# EAGLE design Schaltplan (EAGLE 9.5.1)
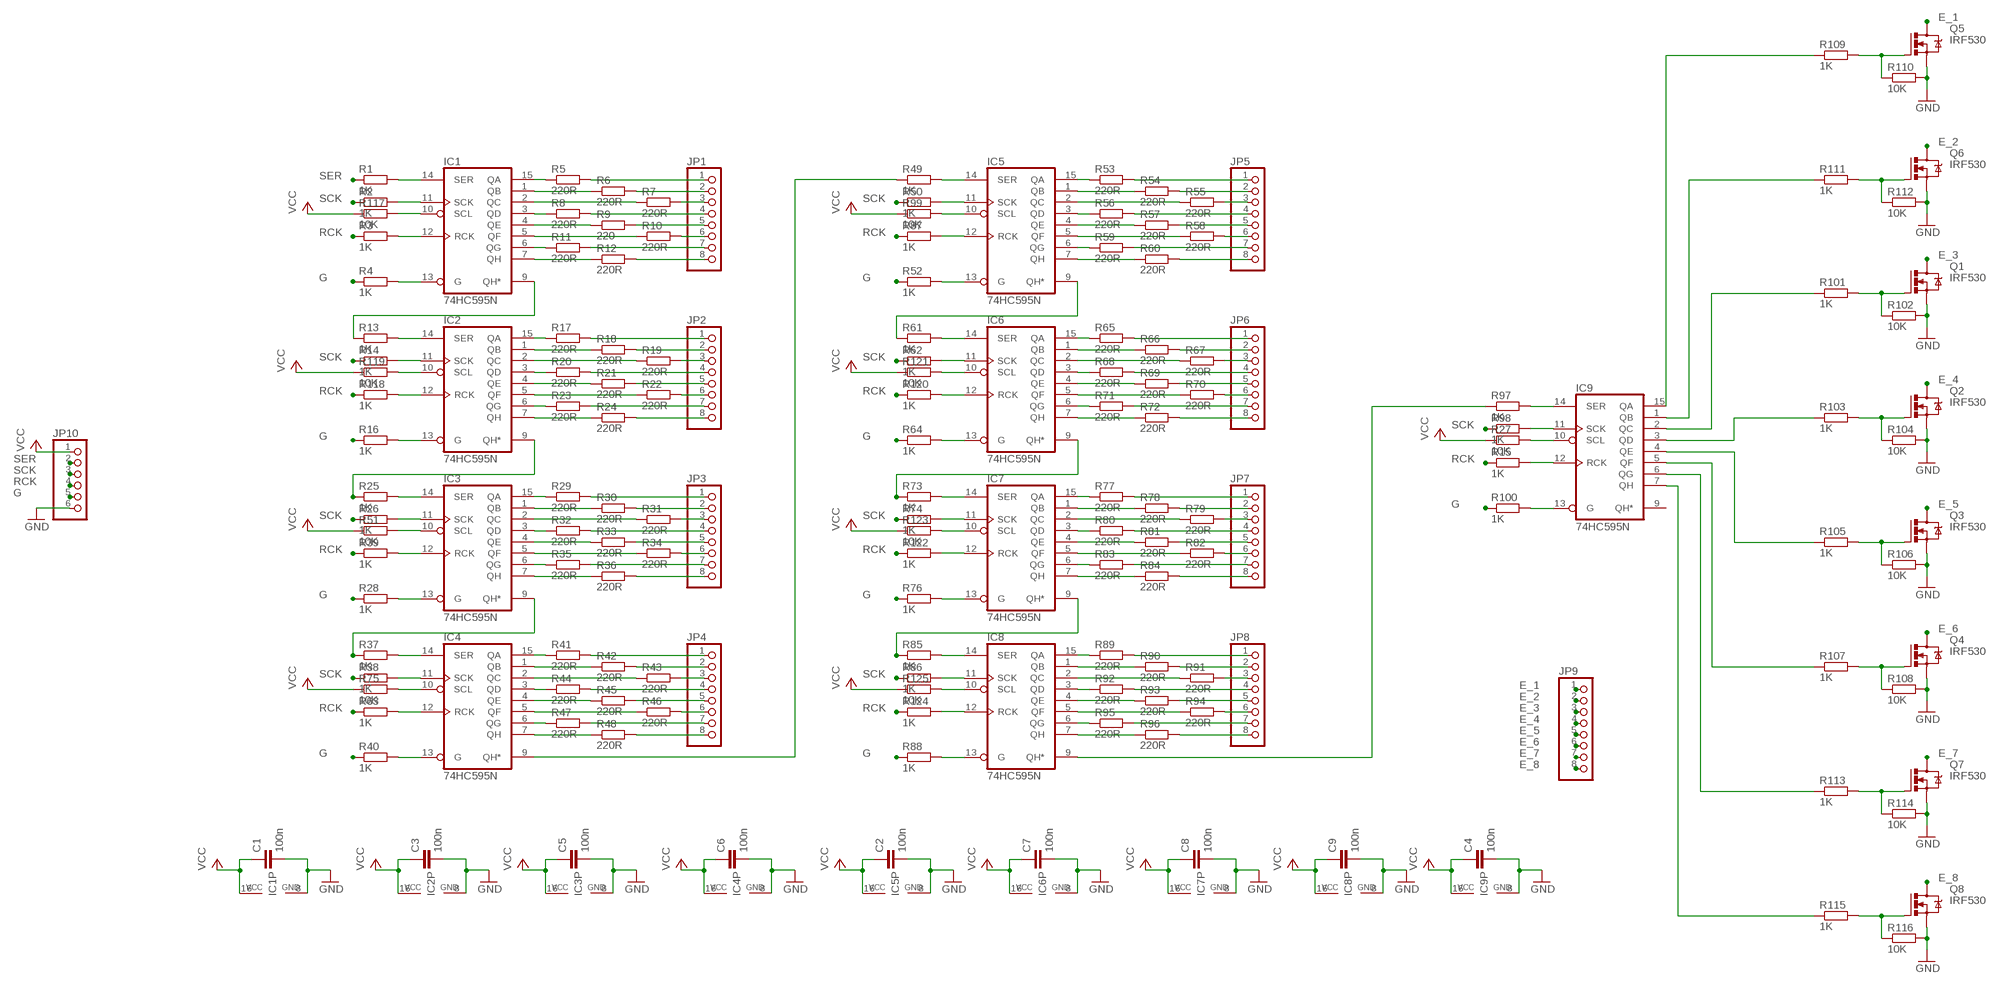
[diagram p0: schematic, sheet 1]

## Parts
C1  100n  C5/3  [C5B3]
C2  100n  C5/3  [C5B3]
C3  100n  C5/3  [C5B3]
C4  100n  C5/3  [C5B3]
C5  100n  C5/3  [C5B3]
C6  100n  C5/3  [C5B3]
C7  100n  C5/3  [C5B3]
C8  100n  C5/3  [C5B3]
C9  100n  C5/3  [C5B3]
IC1  74HC595N  [DIL16]
IC2  74HC595N  [DIL16]
IC3  74HC595N  [DIL16]
IC4  74HC595N  [DIL16]
IC5  74HC595N  [DIL16]
IC6  74HC595N  [DIL16]
IC7  74HC595N  [DIL16]
IC8  74HC595N  [DIL16]
IC9  74HC595N  [DIL16]
JP1  PINHD-1X8  [1X08]
JP2  PINHD-1X8  [1X08]
JP3  PINHD-1X8  [1X08]
JP4  PINHD-1X8  [1X08]
JP5  PINHD-1X8  [1X08]
JP6  PINHD-1X8  [1X08]
JP7  PINHD-1X8  [1X08]
JP8  PINHD-1X8  [1X08]
JP9  PINHD-1X8  [1X08]
JP10  PINHD-1X6  [1X06]
Q1  IRF530  [TO220BV]
Q2  IRF530  [TO220BV]
Q3  IRF530  [TO220BV]
Q4  IRF530  [TO220BV]
Q5  IRF530  [TO220BV]
Q6  IRF530  [TO220BV]
Q7  IRF530  [TO220BV]
Q8  IRF530  [TO220BV]
R1  1K  R-EU_0207/10  [0207/10]
R2  1K  R-EU_0207/10  [0207/10]
R3  1K  R-EU_0207/10  [0207/10]
R4  1K  R-EU_0207/10  [0207/10]
R5  220R  R-EU_0207/10  [0207/10]
R6  220R  R-EU_0207/10  [0207/10]
R7  220R  R-EU_0207/10  [0207/10]
R8  220R  R-EU_0207/10  [0207/10]
R9  220  R-EU_0207/10  [0207/10]
R10  220R  R-EU_0207/10  [0207/10]
R11  220R  R-EU_0207/10  [0207/10]
R12  220R  R-EU_0207/10  [0207/10]
R13  1K  R-EU_0207/10  [0207/10]
R14  1K  R-EU_0207/10  [0207/10]
R15  1K  R-EU_0207/10  [0207/10]
R16  1K  R-EU_0207/10  [0207/10]
R17  220R  R-EU_0207/10  [0207/10]
R18  220R  R-EU_0207/10  [0207/10]
R19  220R  R-EU_0207/10  [0207/10]
R20  220R  R-EU_0207/10  [0207/10]
R21  220R  R-EU_0207/10  [0207/10]
R22  220R  R-EU_0207/10  [0207/10]
R23  220R  R-EU_0207/10  [0207/10]
R24  220R  R-EU_0207/10  [0207/10]
R25  1K  R-EU_0207/10  [0207/10]
R26  1K  R-EU_0207/10  [0207/10]
R27  10K  R-EU_0207/10  [0207/10]
R28  1K  R-EU_0207/10  [0207/10]
R29  220R  R-EU_0207/10  [0207/10]
R30  220R  R-EU_0207/10  [0207/10]
R31  220R  R-EU_0207/10  [0207/10]
R32  220R  R-EU_0207/10  [0207/10]
R33  220R  R-EU_0207/10  [0207/10]
R34  220R  R-EU_0207/10  [0207/10]
R35  220R  R-EU_0207/10  [0207/10]
R36  220R  R-EU_0207/10  [0207/10]
R37  1K  R-EU_0207/10  [0207/10]
R38  1K  R-EU_0207/10  [0207/10]
R39  1K  R-EU_0207/10  [0207/10]
R40  1K  R-EU_0207/10  [0207/10]
R41  220R  R-EU_0207/10  [0207/10]
R42  220R  R-EU_0207/10  [0207/10]
R43  220R  R-EU_0207/10  [0207/10]
R44  220R  R-EU_0207/10  [0207/10]
R45  220R  R-EU_0207/10  [0207/10]
R46  220R  R-EU_0207/10  [0207/10]
R47  220R  R-EU_0207/10  [0207/10]
R48  220R  R-EU_0207/10  [0207/10]
R49  1K  R-EU_0207/10  [0207/10]
R50  1K  R-EU_0207/10  [0207/10]
R51  10K  R-EU_0207/10  [0207/10]
R52  1K  R-EU_0207/10  [0207/10]
R53  220R  R-EU_0207/10  [0207/10]
R54  220R  R-EU_0207/10  [0207/10]
R55  220R  R-EU_0207/10  [0207/10]
R56  220R  R-EU_0207/10  [0207/10]
R57  220R  R-EU_0207/10  [0207/10]
R58  220R  R-EU_0207/10  [0207/10]
R59  220R  R-EU_0207/10  [0207/10]
R60  220R  R-EU_0207/10  [0207/10]
R61  1K  R-EU_0207/10  [0207/10]
R62  1K  R-EU_0207/10  [0207/10]
R63  1K  R-EU_0207/10  [0207/10]
R64  1K  R-EU_0207/10  [0207/10]
R65  220R  R-EU_0207/10  [0207/10]
R66  220R  R-EU_0207/10  [0207/10]
R67  220R  R-EU_0207/10  [0207/10]
R68  220R  R-EU_0207/10  [0207/10]
R69  220R  R-EU_0207/10  [0207/10]
R70  220R  R-EU_0207/10  [0207/10]
R71  220R  R-EU_0207/10  [0207/10]
R72  220R  R-EU_0207/10  [0207/10]
R73  1K  R-EU_0207/10  [0207/10]
R74  1K  R-EU_0207/10  [0207/10]
R75  10K  R-EU_0207/10  [0207/10]
R76  1K  R-EU_0207/10  [0207/10]
R77  220R  R-EU_0207/10  [0207/10]
R78  220R  R-EU_0207/10  [0207/10]
R79  220R  R-EU_0207/10  [0207/10]
R80  220R  R-EU_0207/10  [0207/10]
R81  220R  R-EU_0207/10  [0207/10]
R82  220R  R-EU_0207/10  [0207/10]
R83  220R  R-EU_0207/10  [0207/10]
R84  220R  R-EU_0207/10  [0207/10]
R85  1K  R-EU_0207/10  [0207/10]
R86  1K  R-EU_0207/10  [0207/10]
R87  1K  R-EU_0207/10  [0207/10]
R88  1K  R-EU_0207/10  [0207/10]
R89  220R  R-EU_0207/10  [0207/10]
R90  220R  R-EU_0207/10  [0207/10]
R91  220R  R-EU_0207/10  [0207/10]
R92  220R  R-EU_0207/10  [0207/10]
R93  220R  R-EU_0207/10  [0207/10]
R94  220R  R-EU_0207/10  [0207/10]
R95  220R  R-EU_0207/10  [0207/10]
R96  220R  R-EU_0207/10  [0207/10]
R97  1K  R-EU_0207/10  [0207/10]
R98  1K  R-EU_0207/10  [0207/10]
R99  10K  R-EU_0207/10  [0207/10]
R100  1K  R-EU_0207/10  [0207/10]
R101  1K  R-EU_0207/10  [0207/10]
R102  10K  R-EU_0207/10  [0207/10]
R103  1K  R-EU_0207/10  [0207/10]
R104  10K  R-EU_0207/10  [0207/10]
R105  1K  R-EU_0207/10  [0207/10]
R106  10K  R-EU_0207/10  [0207/10]
R107  1K  R-EU_0207/10  [0207/10]
R108  10K  R-EU_0207/10  [0207/10]
R109  1K  R-EU_0207/10  [0207/10]
R110  10K  R-EU_0207/10  [0207/10]
R111  1K  R-EU_0207/10  [0207/10]
R112  10K  R-EU_0207/10  [0207/10]
R113  1K  R-EU_0207/10  [0207/10]
R114  10K  R-EU_0207/10  [0207/10]
R115  1K  R-EU_0207/10  [0207/10]
R116  10K  R-EU_0207/10  [0207/10]
R117  10K  R-EU_0207/10  [0207/10]
R118  1K  R-EU_0207/10  [0207/10]
R119  10K  R-EU_0207/10  [0207/10]
R120  1K  R-EU_0207/10  [0207/10]
R121  10K  R-EU_0207/10  [0207/10]
R122  1K  R-EU_0207/10  [0207/10]
R123  10K  R-EU_0207/10  [0207/10]
R124  1K  R-EU_0207/10  [0207/10]
R125  10K  R-EU_0207/10  [0207/10]

## Nets
E_1: JP9.1 Q5.D
E_2: JP9.2 Q6.D
E_3: JP9.3 Q1.D
E_4: JP9.4 Q2.D
E_5: JP9.5 Q3.D
E_6: JP9.6 Q4.D
E_7: JP9.7 Q7.D
E_8: JP9.8 Q8.D
G: JP10.5 R4.1 R16.1 R28.1 R40.1 R52.1 R64.1 R76.1 R88.1 R100.1
GND: C1.2 C2.2 C3.2 C4.2 C5.2 C6.2 C7.2 C8.2 C9.2 IC1.8(GND) IC2.8(GND) IC3.8(GND) IC4.8(GND) IC5.8(GND) IC6.8(GND) IC7.8(GND) IC8.8(GND) IC9.8(GND) JP10.6 Q1.S Q2.S Q3.S Q4.S Q5.S Q6.S Q7.S Q8.S R102.2 R104.2 R106.2 R108.2 R110.2 R112.2 R114.2 R116.2
N$1: IC1.14(SER) R1.2
N$2: IC1.11(SCK) R2.2
N$3: IC1.12(RCK) R3.2
N$4: IC1.13(G) R4.2
N$5: JP1.1 R5.2
N$6: IC1.15(QA) R5.1
N$7: IC1.1(QB) R6.1
N$8: JP1.2 R6.2
N$9: JP1.3 R7.2
N$10: IC1.2(QC) R7.1
N$11: IC1.3(QD) R8.1
N$12: JP1.4 R8.2
N$13: JP1.5 R9.2
N$14: IC1.4(QE) R9.1
N$15: IC1.5(QF) R10.1
N$16: JP1.6 R10.2
N$17: JP1.7 R11.2
N$18: IC1.6(QG) R11.1
N$19: IC1.7(QH) R12.1
N$20: JP1.8 R12.2
N$21: IC2.14(SER) R13.2
N$22: IC2.11(SCK) R14.2
N$23: IC2.10(SCL) R119.2
N$24: IC2.13(G) R16.2
N$25: JP2.1 R17.2
N$26: IC2.15(QA) R17.1
N$27: IC2.1(QB) R18.1
N$28: JP2.2 R18.2
N$29: JP2.3 R19.2
N$30: IC2.2(QC) R19.1
N$31: IC2.3(QD) R20.1
N$32: JP2.4 R20.2
N$33: JP2.5 R21.2
N$34: IC2.4(QE) R21.1
N$35: IC2.5(QF) R22.1
N$36: JP2.6 R22.2
N$37: JP2.7 R23.2
N$38: IC2.6(QG) R23.1
N$39: IC2.7(QH) R24.1
N$40: JP2.8 R24.2
N$41: IC3.14(SER) R25.2
N$42: IC3.11(SCK) R26.2
N$43: IC3.12(RCK) R39.2
N$44: IC3.13(G) R28.2
N$45: JP3.1 R29.2
N$46: IC3.15(QA) R29.1
N$47: IC3.1(QB) R30.1
N$48: JP3.2 R30.2
N$49: JP3.3 R31.2
N$50: IC3.2(QC) R31.1
N$51: IC3.3(QD) R32.1
N$52: JP3.4 R32.2
N$53: JP3.5 R33.2
N$54: IC3.4(QE) R33.1
N$55: IC3.5(QF) R34.1
N$56: JP3.6 R34.2
N$57: JP3.7 R35.2
N$58: IC3.6(QG) R35.1
N$59: IC3.7(QH) R36.1
N$60: JP3.8 R36.2
N$61: IC4.14(SER) R37.2
N$62: IC4.11(SCK) R38.2
N$63: IC3.10(SCL) R51.2
N$64: IC4.13(G) R40.2
N$65: JP4.1 R41.2
N$66: IC4.15(QA) R41.1
N$67: IC4.1(QB) R42.1
N$68: JP4.2 R42.2
N$69: JP4.3 R43.2
N$70: IC4.2(QC) R43.1
N$71: IC4.3(QD) R44.1
N$72: JP4.4 R44.2
N$73: JP4.5 R45.2
N$74: IC4.4(QE) R45.1
N$75: IC4.5(QF) R46.1
N$76: JP4.6 R46.2
N$77: JP4.7 R47.2
N$78: IC4.6(QG) R47.1
N$79: IC4.7(QH) R48.1
N$80: JP4.8 R48.2
N$81: IC5.14(SER) R49.2
N$82: IC5.11(SCK) R50.2
N$83: IC4.10(SCL) R75.2
N$84: IC5.13(G) R52.2
N$85: JP5.1 R53.2
N$86: IC5.15(QA) R53.1
N$87: IC5.1(QB) R54.1
N$88: JP5.2 R54.2
N$89: JP5.3 R55.2
N$90: IC5.2(QC) R55.1
N$91: IC5.3(QD) R56.1
N$92: JP5.4 R56.2
N$93: JP5.5 R57.2
N$94: IC5.4(QE) R57.1
N$95: IC5.5(QF) R58.1
N$96: JP5.6 R58.2
N$97: JP5.7 R59.2
N$98: IC5.6(QG) R59.1
N$99: IC5.7(QH) R60.1
N$100: JP5.8 R60.2
N$101: IC6.14(SER) R61.2
N$102: IC6.11(SCK) R62.2
N$103: IC4.12(RCK) R63.2
N$104: IC6.13(G) R64.2
N$105: JP6.1 R65.2
N$106: IC6.15(QA) R65.1
N$107: IC6.1(QB) R66.1
N$108: JP6.2 R66.2
N$109: JP6.3 R67.2
N$110: IC6.2(QC) R67.1
N$111: IC6.3(QD) R68.1
N$112: JP6.4 R68.2
N$113: JP6.5 R69.2
N$114: IC6.4(QE) R69.1
N$115: IC6.5(QF) R70.1
N$116: JP6.6 R70.2
N$117: JP6.7 R71.2
N$118: IC6.6(QG) R71.1
N$119: IC6.7(QH) R72.1
N$120: JP6.8 R72.2
N$121: IC7.14(SER) R73.2
N$122: IC7.11(SCK) R74.2
N$123: IC6.10(SCL) R121.2
N$124: IC7.13(G) R76.2
N$125: JP7.1 R77.2
N$126: IC7.15(QA) R77.1
N$127: IC7.1(QB) R78.1
N$128: JP7.2 R78.2
N$129: JP7.3 R79.2
N$130: IC7.2(QC) R79.1
N$131: IC7.3(QD) R80.1
N$132: JP7.4 R80.2
N$133: JP7.5 R81.2
N$134: IC7.4(QE) R81.1
N$135: IC7.5(QF) R82.1
N$136: JP7.6 R82.2
N$137: JP7.7 R83.2
N$138: IC7.6(QG) R83.1
N$139: IC7.7(QH) R84.1
N$140: JP7.8 R84.2
N$141: IC8.14(SER) R85.2
N$142: IC8.11(SCK) R86.2
N$143: IC6.12(RCK) R120.2
N$144: IC8.13(G) R88.2
N$145: JP8.1 R89.2
N$146: IC8.15(QA) R89.1
N$147: IC8.1(QB) R90.1
N$148: JP8.2 R90.2
N$149: JP8.3 R91.2
N$150: IC8.2(QC) R91.1
N$151: IC8.3(QD) R92.1
N$152: JP8.4 R92.2
N$153: JP8.5 R93.2
N$154: IC8.4(QE) R93.1
N$155: IC8.5(QF) R94.1
N$156: JP8.6 R94.2
N$157: JP8.7 R95.2
N$158: IC8.6(QG) R95.1
N$159: IC8.7(QH) R96.1
N$160: JP8.8 R96.2
N$161: IC9.14(SER) R97.2
N$162: IC9.11(SCK) R98.2
N$163: IC7.10(SCL) R123.2
N$164: IC9.13(G) R100.2
N$165: Q1.G R101.2 R102.1
N$166: Q2.G R103.2 R104.1
N$167: Q3.G R105.2 R106.1
N$168: Q4.G R107.2 R108.1
N$169: Q5.G R109.2 R110.1
N$170: Q6.G R111.2 R112.1
N$171: Q7.G R113.2 R114.1
N$172: Q8.G R115.2 R116.1
N$173: IC9.15(QA) R109.1
N$174: IC9.1(QB) R111.1
N$175: IC9.2(QC) R101.1
N$176: IC9.3(QD) R103.1
N$177: IC9.4(QE) R105.1
N$178: IC9.5(QF) R107.1
N$179: IC9.6(QG) R113.1
N$180: IC9.7(QH) R115.1
N$181: IC8.9(QH*) R97.1
N$182: IC1.9(QH*) R13.1
N$183: IC4.9(QH*) R49.1
N$184: IC5.9(QH*) R61.1
N$185: IC1.10(SCL) R117.2
N$186: IC2.12(RCK) R118.2
N$187: IC7.12(RCK) R122.2
N$188: IC8.10(SCL) R125.2
N$189: IC8.12(RCK) R124.2
N$190: IC5.10(SCL) R99.2
N$191: IC5.12(RCK) R87.2
N$192: IC9.10(SCL) R27.2
N$193: IC9.12(RCK) R15.2
RCK: JP10.4 R3.1 R15.1 R39.1 R63.1 R87.1 R118.1 R120.1 R122.1 R124.1
SCK: JP10.3 R2.1 R14.1 R26.1 R38.1 R50.1 R62.1 R74.1 R86.1 R98.1
SER: JP10.2 R1.1
SER1: IC2.9(QH*) R25.1
SER2: IC3.9(QH*) R37.1
SER3: IC6.9(QH*) R73.1
SER4: IC7.9(QH*) R85.1
VCC: C1.1 C2.1 C3.1 C4.1 C5.1 C6.1 C7.1 C8.1 C9.1 IC1.16(VCC) IC2.16(VCC) IC3.16(VCC) IC4.16(VCC) IC5.16(VCC) IC6.16(VCC) IC7.16(VCC) IC8.16(VCC) IC9.16(VCC) JP10.1 R27.1 R51.1 R75.1 R99.1 R117.1 R119.1 R121.1 R123.1 R125.1
Unconnected: IC9.9(QH*)

## Library data of the parts
C1-C9 = capacitor-wima:C: CAPACITOR naming: grid - package width
IC1-IC9 = 74xx-eu:74*595: 8-bit SHIFT REGISTER, output latch
JP1-JP9 = pinhead:PINHD-1X8: PIN HEADER
JP10 = pinhead:PINHD-1X6: PIN HEADER
Q1-Q8 = transistor-power:IRF530: HEXFET Power MOSFET
R1-R125 = resistor:R-EU_: RESISTOR, European symbol

## Board
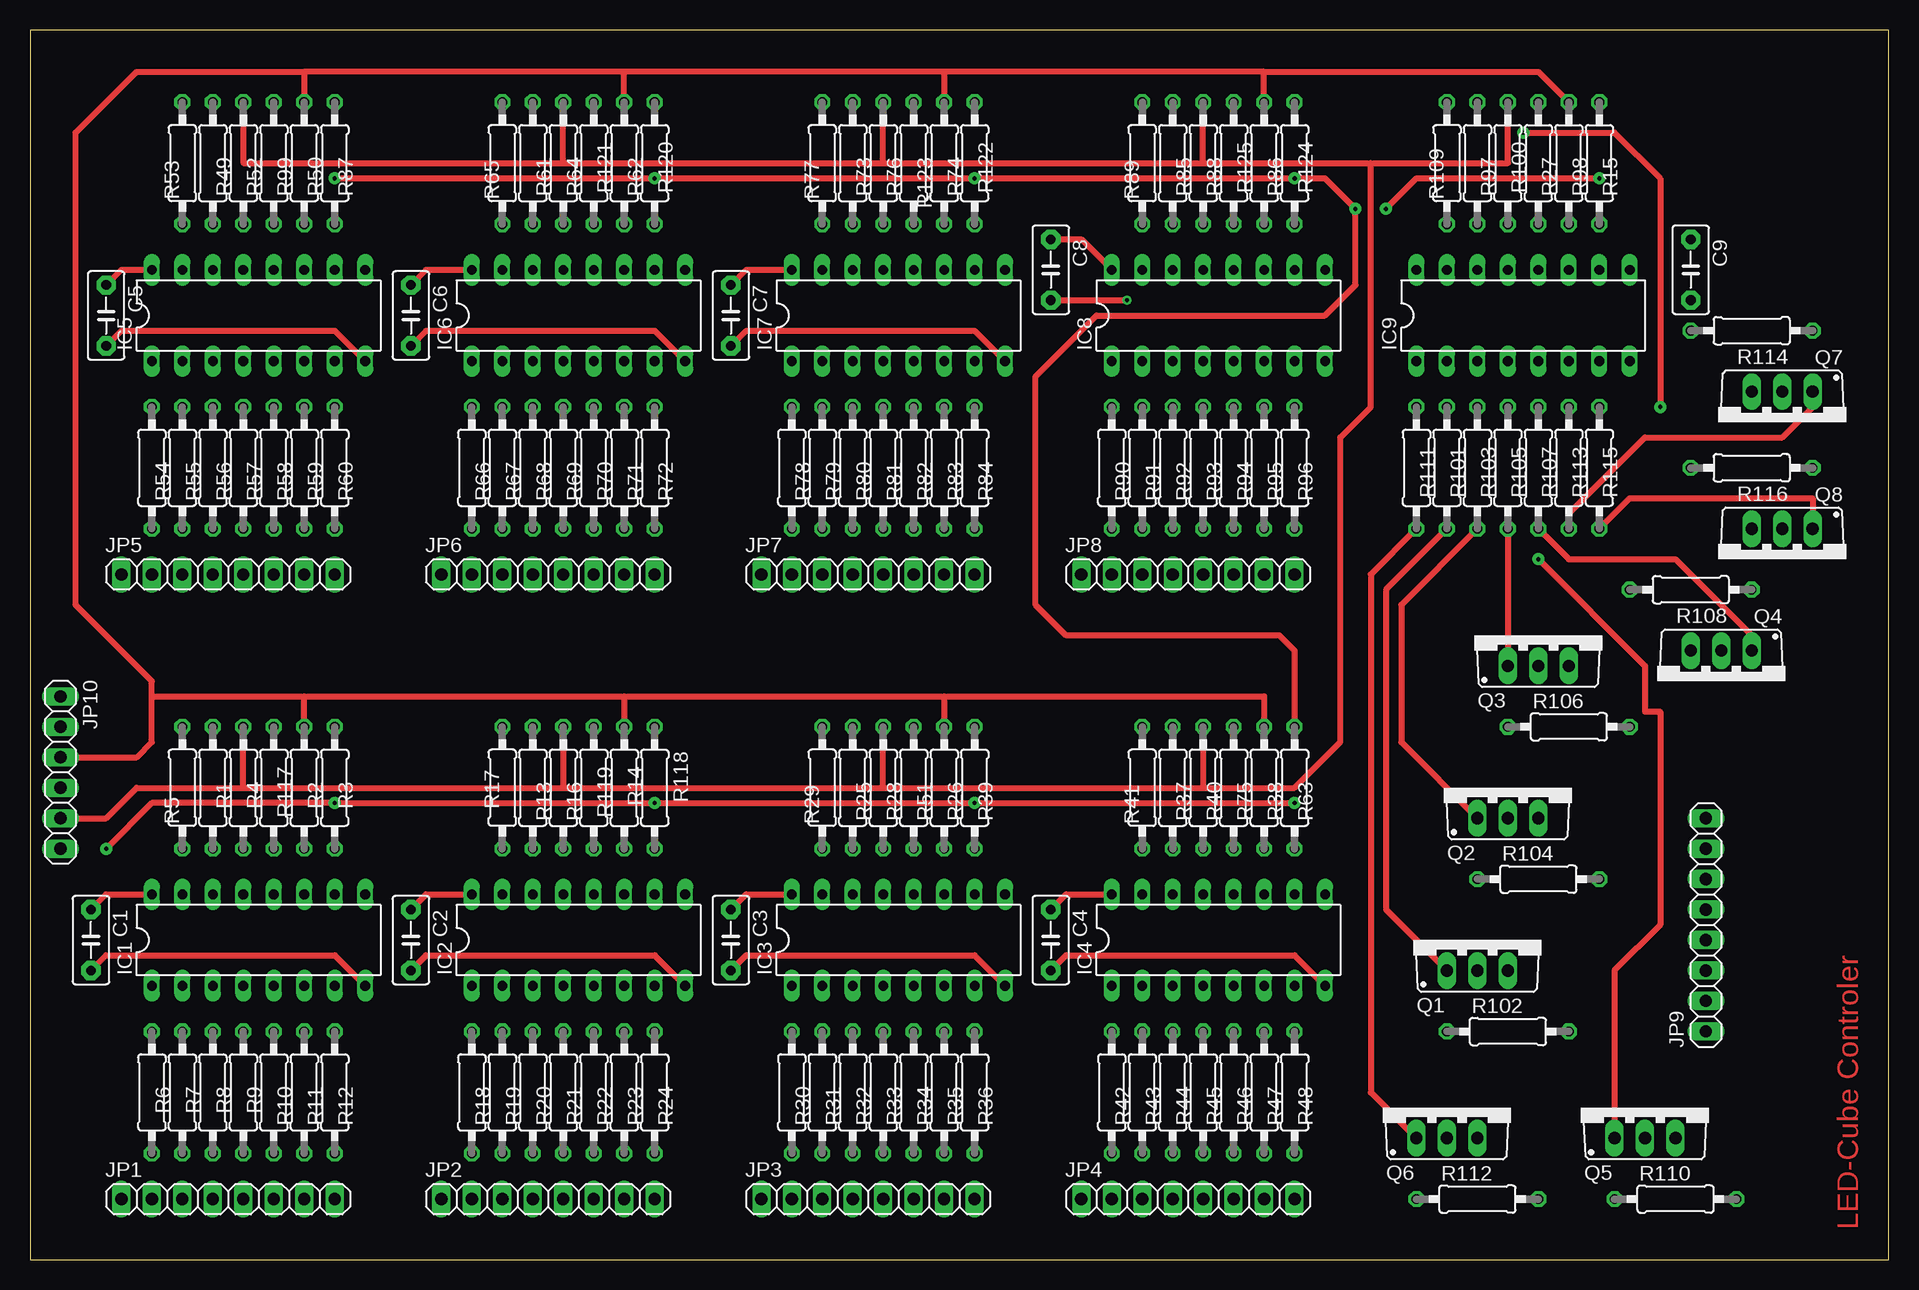
[diagram p1: board, top side]
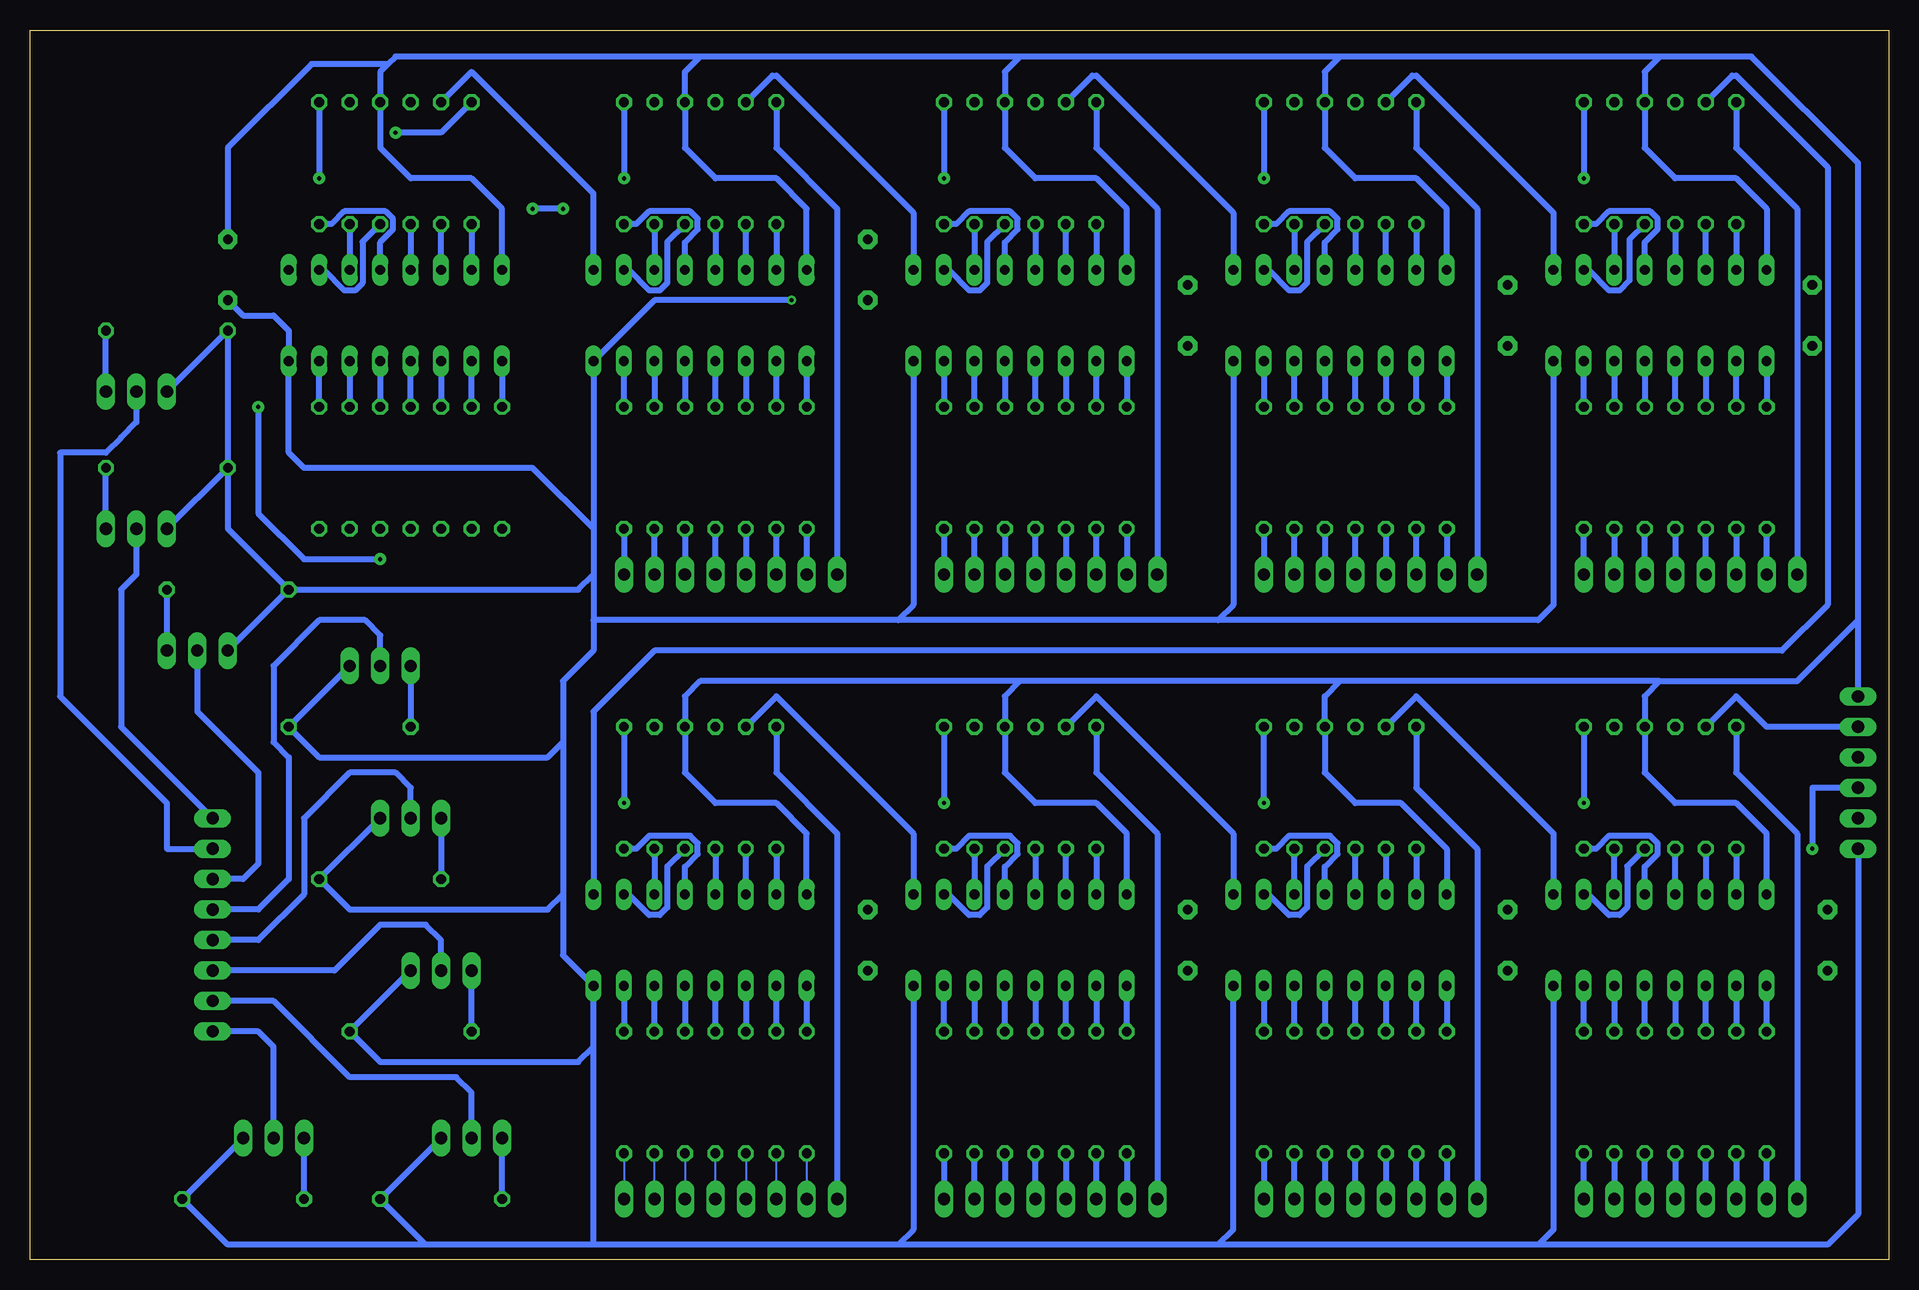
[diagram p2: board, bottom side, seen from below]

Size 154.92 x 102.54 mm. Coordinates in mm from the lower left corner, seen from the top.
Outline: 0,0 154.92,0 154.92,102.54 0,102.54 0,0
Copper layers (1*16): Top 0.035mm / dielectric 1.5mm / Bottom 0.035mm
Design rules "default": minimum track width 6mil, minimum drill 0.35mm, track to track 6mil, track to pad 6mil, pad to pad 6mil, via to via 6mil, smd to smd 6mil, copper to edge 40mil, drill to drill 6mil, minimum pad ring 10mil, minimum via ring 8mil, stop-mask expansion 4mil, vias tented up to drill 0mil, thermal gap 10mil

### Footprints (pad centres in the part's own frame; a part is rotated, then mirrored left to right if it is on the bottom)
C5B3 = drill 0.813 pad 1.6 octagon: 1 -2.54,0; 2 2.54,0
DIL16 = drill 0.813 long: 1 -8.89,-3.81; 2 -6.35,-3.81; 3 -3.81,-3.81; 4 -1.27,-3.81; 5 1.27,-3.81; 6 3.81,-3.81; 7 6.35,-3.81; 8 8.89,-3.81; 9 8.89,3.81; 10 6.35,3.81; 11 3.81,3.81; 12 1.27,3.81; 13 -1.27,3.81; 14 -3.81,3.81; 15 -6.35,3.81; 16 -8.89,3.81
1X08 = drill 1.016 long: 1 -8.89,0; 2 -6.35,0; 3 -3.81,0; 4 -1.27,0; 5 1.27,0; 6 3.81,0; 7 6.35,0; 8 8.89,0
1X06 = drill 1.016 long: 1 -6.35,0; 2 -3.81,0; 3 -1.27,0; 4 1.27,0; 5 3.81,0; 6 6.35,0
TO220BV = drill 1.016 long: D 0,-2.54; G -2.54,-2.54; S 2.54,-2.54
0207/10 = drill 0.813 octagon: 1 -5.08,0; 2 5.08,0

### Placement (x,y rotation side)
C1  5.08,26.67 270 top
C2  31.75,26.67 270 top
C3  58.42,26.67 270 top
C4  85.09,26.67 270 top
C5  6.35,78.74 270 top
C6  31.75,78.74 270 top
C7  58.42,78.74 270 top
C8  85.09,82.55 270 top
C9  138.43,82.55 270 top
IC1  19.05,26.67 0 top
IC2  45.72,26.67 0 top
IC3  72.39,26.67 0 top
IC4  99.06,26.67 0 top
IC5  19.05,78.74 0 top
IC6  45.72,78.74 0 top
IC7  72.39,78.74 0 top
IC8  99.06,78.74 0 top
IC9  124.46,78.74 0 top
JP1  16.51,5.08 0 top
JP2  43.18,5.08 0 top
JP3  69.85,5.08 0 top
JP4  96.52,5.08 0 top
JP5  16.51,57.15 0 top
JP6  43.18,57.15 0 top
JP7  69.85,57.15 0 top
JP8  96.52,57.15 0 top
JP9  139.7,27.94 90 top
JP10  2.54,40.64 270 top
Q1  120.65,26.67 0 top
Q2  123.19,39.37 0 top
Q3  125.73,52.07 0 top
Q4  140.97,48.26 180 top
Q5  134.62,12.7 0 top
Q6  118.11,12.7 0 top
Q7  146.05,69.85 180 top
Q8  146.05,58.42 180 top
R1  15.24,39.37 270 top
R2  22.86,39.37 270 top
R3  25.4,39.37 270 top
R4  17.78,39.37 270 top
R5  12.7,39.37 90 top
R6  10.16,13.97 270 top
R7  12.7,13.97 270 top
R8  15.24,13.97 270 top
R9  17.78,13.97 270 top
R10  20.32,13.97 270 top
R11  22.86,13.97 270 top
R12  25.4,13.97 270 top
R13  41.91,39.37 270 top
R14  49.53,39.37 270 top
R15  130.81,91.44 270 top
R16  44.45,39.37 270 top
R17  39.37,39.37 90 top
R18  36.83,13.97 270 top
R19  39.37,13.97 270 top
R20  41.91,13.97 270 top
R21  44.45,13.97 270 top
R22  46.99,13.97 270 top
R23  49.53,13.97 270 top
R24  52.07,13.97 270 top
R25  68.58,39.37 270 top
R26  76.2,39.37 270 top
R27  125.73,91.44 270 top
R28  71.12,39.37 270 top
R29  66.04,39.37 90 top
R30  63.5,13.97 270 top
R31  66.04,13.97 270 top
R32  68.58,13.97 270 top
R33  71.12,13.97 270 top
R34  73.66,13.97 270 top
R35  76.2,13.97 270 top
R36  78.74,13.97 270 top
R37  95.25,39.37 270 top
R38  102.87,39.37 270 top
R39  78.74,39.37 270 top
R40  97.79,39.37 270 top
R41  92.71,39.37 90 top
R42  90.17,13.97 270 top
R43  92.71,13.97 270 top
R44  95.25,13.97 270 top
R45  97.79,13.97 270 top
R46  100.33,13.97 270 top
R47  102.87,13.97 270 top
R48  105.41,13.97 270 top
R49  15.24,91.44 270 top
R50  22.86,91.44 270 top
R51  73.66,39.37 270 top
R52  17.78,91.44 270 top
R53  12.7,91.44 90 top
R54  10.16,66.04 270 top
R55  12.7,66.04 270 top
R56  15.24,66.04 270 top
R57  17.78,66.04 270 top
R58  20.32,66.04 270 top
R59  22.86,66.04 270 top
R60  25.4,66.04 270 top
R61  41.91,91.44 270 top
R62  49.53,91.44 270 top
R63  105.41,39.37 270 top
R64  44.45,91.44 270 top
R65  39.37,91.44 90 top
R66  36.83,66.04 270 top
R67  39.37,66.04 270 top
R68  41.91,66.04 270 top
R69  44.45,66.04 270 top
R70  46.99,66.04 270 top
R71  49.53,66.04 270 top
R72  52.07,66.04 270 top
R73  68.58,91.44 270 top
R74  76.2,91.44 270 top
R75  100.33,39.37 270 top
R76  71.12,91.44 270 top
R77  66.04,91.44 90 top
R78  63.5,66.04 270 top
R79  66.04,66.04 270 top
R80  68.58,66.04 270 top
R81  71.12,66.04 270 top
R82  73.66,66.04 270 top
R83  76.2,66.04 270 top
R84  78.74,66.04 270 top
R85  95.25,91.44 270 top
R86  102.87,91.44 270 top
R87  25.4,91.44 270 top
R88  97.79,91.44 270 top
R89  92.71,91.44 90 top
R90  90.17,66.04 270 top
R91  92.71,66.04 270 top
R92  95.25,66.04 270 top
R93  97.79,66.04 270 top
R94  100.33,66.04 270 top
R95  102.87,66.04 270 top
R96  105.41,66.04 270 top
R97  120.65,91.44 270 top
R98  128.27,91.44 270 top
R99  20.32,91.44 270 top
R100  123.19,91.44 270 top
R101  118.11,66.04 270 top
R102  123.19,19.05 0 top
R103  120.65,66.04 270 top
R104  125.73,31.75 0 top
R105  123.19,66.04 270 top
R106  128.27,44.45 0 top
R107  125.73,66.04 270 top
R108  138.43,55.88 180 top
R109  118.11,91.44 90 top
R110  137.16,5.08 0 top
R111  115.57,66.04 270 top
R112  120.65,5.08 0 top
R113  128.27,66.04 270 top
R114  143.51,77.47 180 top
R115  130.81,66.04 270 top
R116  143.51,66.04 180 top
R117  20.32,39.37 270 top
R118  52.07,39.37 270 top
R119  46.99,39.37 270 top
R120  52.07,91.44 270 top
R121  46.99,91.44 270 top
R122  78.74,91.44 270 top
R123  73.66,91.44 270 top
R124  105.41,91.44 270 top
R125  100.33,91.44 270 top

### Tracks (layer width: path | path; a pad name or v marks a point on that pad's centre or on a via)
E_1
  Bottom 0.508: Q5.D 134.62,17.78 135.89,19.05 JP9.1
E_2
  Bottom 0.508: 118.11,11.43 Q6.D 118.11,13.97 119.38,15.24 128.27,15.24 134.62,21.59 JP9.2
E_3
  Bottom 0.508: Q1.D 120.65,26.67 121.92,27.94 125.73,27.94 129.54,24.13 JP9.3
E_4
  Bottom 0.508: Q2.D 123.19,39.37 124.46,40.64 128.27,40.64 132.08,36.83 132.08,30.48 135.89,26.67 JP9.4
E_5
  Bottom 0.508: Q3.D 125.73,52.07 127,53.34 130.81,53.34 134.62,49.53 134.62,43.18 133.35,41.91 133.35,31.75 135.89,29.21 JP9.5
E_6
  Bottom 0.508: 140.97,46.99 Q4.D 140.97,45.72 135.89,40.64 135.89,33.02 137.16,31.75 JP9.6
E_7
  Bottom 0.508: Q7.D 146.05,69.85 147.32,68.58 148.59,67.31 152.4,67.31 152.4,46.99 143.51,38.1 143.51,34.29 JP9.7
E_8
  Bottom 0.508: Q8.D 146.05,57.15 147.32,55.88 147.32,44.45 JP9.8
G
  Top 0.508: JP10.5 6.35,36.83 8.89,39.37 17.78,39.37 | 17.78,39.37 R4.1 | 17.78,39.37 44.45,39.37 | R16.1 44.45,39.37 | 44.45,39.37 71.12,39.37 | 71.12,39.37 R28.1 | 71.12,39.37 97.79,39.37 | R40.1 97.79,39.37 | R52.1 17.78,91.44 44.45,91.44 | 44.45,91.44 R64.1 | 44.45,91.44 71.12,91.44 | 71.12,91.44 R76.1 | 71.12,91.44 97.79,91.44 | 97.79,91.44 R88.1 | 97.79,91.44 111.76,91.44 | 111.76,91.44 123.19,91.44 R100.1 | 97.79,39.37 105.41,39.37 109.22,43.18 109.22,68.58 111.76,71.12 111.76,91.44
GND  (via drill 0.35)
  Top 0.508: C5.2 7.62,77.47 25.4,77.47 IC5.8 | C6.2 33.02,77.47 52.07,77.47 IC6.8 | C7.2 59.69,77.47 78.74,77.47 IC7.8 | C1.2 6.35,25.4 25.4,25.4 IC1.8 | C2.2 33.02,25.4 52.07,25.4 IC2.8 | C3.2 59.69,25.4 78.74,25.4 IC3.8 | C4.2 86.36,25.4 105.41,25.4 IC4.8 | C8.2 v91.44,80.01
  Bottom 0.508: 55.88,53.34 29.21,53.34 27.94,54.61 IC5.8 | 55.88,53.34 82.55,53.34 | 82.55,53.34 107.95,53.34 | 107.95,60.96 IC8.8 102.87,80.01 v91.44,80.01 | 107.95,60.96 107.95,57.15 | 107.95,57.15 107.95,53.34 | IC6.8 54.61,54.61 55.88,53.34 | IC7.8 81.28,54.61 82.55,53.34 | 29.21,1.27 27.94,2.54 IC1.8 | 107.95,1.27 107.95,17.78 | 107.95,17.78 IC4.8 110.49,25.4 110.49,30.48 | 29.21,1.27 55.88,1.27 | 55.88,1.27 82.55,1.27 | 82.55,1.27 107.95,1.27 | 55.88,1.27 54.61,2.54 IC2.8 | IC3.8 81.28,2.54 82.55,1.27 | 107.95,53.34 107.95,50.8 110.49,48.26 110.49,43.18 | 110.49,43.18 110.49,30.48 | 107.95,60.96 113.03,66.04 132.08,66.04 133.35,67.31 IC9.8 133.35,77.47 134.62,78.74 137.16,78.74 C9.2 | JP10.6 2.54,3.81 5.08,1.27 29.21,1.27 | Q5.S R110.2 138.43,1.27 121.92,1.27 | Q6.S R112.2 121.92,1.27 | R108.2 Q4.S | Q1.S R102.2 125.73,16.51 109.22,16.51 107.95,17.78 | Q2.S R104.2 128.27,29.21 111.76,29.21 110.49,30.48 | Q3.S R106.2 130.81,41.91 111.76,41.91 110.49,43.18 | R116.2 Q8.S 143.51,59.69 | Q7.S R114.2 R116.2 | 107.95,1.27 121.92,1.27 | R108.2 109.22,55.88 107.95,57.15 | R116.2 138.43,60.96 R108.2
N$1
  Bottom 0.508: R1.2 IC1.14
N$2
  Bottom 0.508: IC1.11 R2.2
N$3
  Bottom 0.508: R3.2 24.37,34.29 23.3,35.36 19.88,35.36 19.25,34.73 19.25,33.85 20.32,32.78 IC1.12
N$4
  Bottom 0.508: IC1.13 R4.2
N$5
  Bottom 0.508: R5.2 12.7,40.64 7.62,35.56 JP1.1
N$6
  Bottom 0.508: R5.1 IC1.15
N$7
  Bottom 0.508: R6.1 IC1.1
N$8
  Bottom 0.508: JP1.2 R6.2
N$9
  Bottom 0.508: R7.2 JP1.3
N$10
  Bottom 0.508: IC1.2 R7.1
N$11
  Bottom 0.508: R8.1 IC1.3
N$12
  Bottom 0.508: JP1.4 R8.2
N$13
  Bottom 0.508: R9.2 JP1.5
N$14
  Bottom 0.508: IC1.4 R9.1
N$15
  Bottom 0.508: R10.1 IC1.5
N$16
  Bottom 0.508: JP1.6 R10.2
N$17
  Bottom 0.508: R11.2 JP1.7
N$18
  Bottom 0.508: IC1.6 R11.1
N$19
  Bottom 0.508: R12.1 IC1.7
N$20
  Bottom 0.508: JP1.8 R12.2
N$21
  Bottom 0.508: R13.2 IC2.14
N$22
  Bottom 0.508: IC2.11 R14.2
N$23
  Bottom 0.508: IC2.10 51.7,30.48 49.97,28.75 49.09,28.75 48.46,29.38 48.46,32.82 R119.2
N$24
  Bottom 0.508: IC2.13 R16.2
N$25
  Bottom 0.508: R17.2 39.37,39.37 34.29,34.29 JP2.1
N$26
  Bottom 0.508: R17.1 IC2.15
N$27
  Bottom 0.508: IC2.1 R18.1
N$28
  Bottom 0.508: R18.2 JP2.2
N$29
  Bottom 0.508: JP2.3 R19.2
N$30
  Bottom 0.508: R19.1 IC2.2
N$31
  Bottom 0.508: IC2.3 R20.1
N$32
  Bottom 0.508: R20.2 JP2.4
N$33
  Bottom 0.508: JP2.5 R21.2
N$34
  Bottom 0.508: R21.1 IC2.4
N$35
  Bottom 0.508: IC2.5 R22.1
N$36
  Bottom 0.508: R22.2 JP2.6
N$37
  Bottom 0.508: JP2.7 R23.2
N$38
  Bottom 0.508: R23.1 IC2.6
N$39
  Bottom 0.508: IC2.7 R24.1
N$40
  Bottom 0.508: R24.2 JP2.8
N$41
  Bottom 0.508: IC3.14 R25.2
N$42
  Bottom 0.508: R26.2 IC3.11
N$43
  Bottom 0.508: R39.2 77.71,34.29 76.64,35.36 73.22,35.36 72.59,34.73 72.59,33.85 73.66,32.78 IC3.12
N$44
  Bottom 0.508: R28.2 IC3.13
N$45
  Bottom 0.508: R29.2 66.04,40.64 60.96,35.56 JP3.1
N$46
  Bottom 0.508: R29.1 IC3.15
N$47
  Bottom 0.508: R30.1 IC3.1
N$48
  Bottom 0.508: R30.2 JP3.2
N$49
  Bottom 0.508: JP3.3 R31.2
N$50
  Bottom 0.508: IC3.2 R31.1
N$51
  Bottom 0.508: R32.1 IC3.3
N$52
  Bottom 0.508: R32.2 JP3.4
N$53
  Bottom 0.508: JP3.5 R33.2
N$54
  Bottom 0.508: IC3.4 R33.1
N$55
  Bottom 0.508: R34.1 IC3.5
N$56
  Bottom 0.508: R34.2 JP3.6
N$57
  Bottom 0.508: JP3.7 R35.2
N$58
  Bottom 0.508: IC3.6 R35.1
N$59
  Bottom 0.508: R36.1 IC3.7
N$60
  Bottom 0.508: R36.2 JP3.8
N$61
  Bottom 0.508: IC4.14 R37.2
N$62
  Bottom 0.508: R38.2 IC4.11
N$63
  Bottom 0.508: IC3.10 78.37,30.48 76.64,28.75 75.76,28.75 75.13,29.38 75.13,32.82 R51.2
N$64
  Bottom 0.508: R40.2 IC4.13
N$65
  Bottom 0.508: R41.2 92.71,40.64 87.63,35.56 JP4.1
N$66
  Bottom 0.508: R41.1 IC4.15
N$67
  Bottom 0.508: IC4.1 R42.1
N$68
  Bottom 0.152: R42.2 JP4.2
N$69
  Bottom 0.152: JP4.3 R43.2
N$70
  Bottom 0.508: R43.1 IC4.2
N$71
  Bottom 0.508: IC4.3 R44.1
N$72
  Bottom 0.152: R44.2 JP4.4
N$73
  Bottom 0.152: JP4.5 R45.2
N$74
  Bottom 0.508: R45.1 IC4.4
N$75
  Bottom 0.508: IC4.5 R46.1
N$76
  Bottom 0.152: R46.2 JP4.6
N$77
  Bottom 0.152: JP4.7 R47.2
N$78
  Bottom 0.508: R47.1 IC4.6
N$79
  Bottom 0.508: IC4.7 R48.1
N$80
  Bottom 0.152: R48.2 JP4.8
N$81
  Bottom 0.508: IC5.14 R49.2
N$82
  Bottom 0.508: R50.2 IC5.11
N$83
  Bottom 0.508: IC4.10 105.04,30.48 103.31,28.75 102.43,28.75 101.8,29.38 101.8,32.82 R75.2
N$84
  Bottom 0.508: R52.2 IC5.13
N$85
  Bottom 0.508: R53.2 12.7,92.71 7.62,87.63 JP5.1
N$86
  Bottom 0.508: R53.1 IC5.15
N$87
  Bottom 0.508: IC5.1 R54.1
N$88
  Bottom 0.508: JP5.2 R54.2
N$89
  Bottom 0.508: R55.2 JP5.3
N$90
  Bottom 0.508: R55.1 IC5.2
N$91
  Bottom 0.508: IC5.3 R56.1
N$92
  Bottom 0.508: JP5.4 R56.2
N$93
  Bottom 0.508: R57.2 JP5.5
N$94
  Bottom 0.508: R57.1 IC5.4
N$95
  Bottom 0.508: IC5.5 R58.1
N$96
  Bottom 0.508: JP5.6 R58.2
N$97
  Bottom 0.508: R59.2 JP5.7
N$98
  Bottom 0.508: IC5.6 R59.1
N$99
  Bottom 0.508: R60.1 IC5.7
N$100
  Bottom 0.508: JP5.8 R60.2
N$101
  Bottom 0.508: IC6.14 R61.2
N$102
  Bottom 0.508: R62.2 IC6.11
N$103
  Bottom 0.508: R63.2 104.38,34.29 103.31,35.36 99.89,35.36 99.26,34.73 99.26,33.85 100.33,32.78 IC4.12
N$104
  Bottom 0.508: R64.2 IC6.13
N$105
  Bottom 0.508: R65.2 39.37,92.71 34.29,87.63 JP6.1
N$106
  Bottom 0.508: R65.1 IC6.15
N$107
  Bottom 0.508: IC6.1 R66.1
N$108
  Bottom 0.508: R66.2 JP6.2
N$109
  Bottom 0.508: JP6.3 R67.2
N$110
  Bottom 0.508: R67.1 IC6.2
N$111
  Bottom 0.508: IC6.3 R68.1
N$112
  Bottom 0.508: R68.2 JP6.4
N$113
  Bottom 0.508: JP6.5 R69.2
N$114
  Bottom 0.508: R69.1 IC6.4
N$115
  Bottom 0.508: IC6.5 R70.1
N$116
  Bottom 0.508: R70.2 JP6.6
N$117
  Bottom 0.508: JP6.7 R71.2
N$118
  Bottom 0.508: R71.1 IC6.6
N$119
  Bottom 0.508: IC6.7 R72.1
N$120
  Bottom 0.508: R72.2 JP6.8
N$121
  Bottom 0.508: IC7.14 R73.2
N$122
  Bottom 0.508: R74.2 IC7.11
N$123
  Bottom 0.508: IC6.10 51.7,82.55 49.97,80.82 49.09,80.82 48.46,81.45 48.46,84.89 R121.2
N$124
  Bottom 0.508: R76.2 IC7.13
N$125
  Bottom 0.508: R77.2 66.04,92.71 60.96,87.63 JP7.1
N$126
  Bottom 0.508: R77.1 IC7.15
N$127
  Bottom 0.508: IC7.1 R78.1
N$128
  Bottom 0.508: R78.2 JP7.2
N$129
  Bottom 0.508: JP7.3 R79.2
N$130
  Bottom 0.508: R79.1 IC7.2
N$131
  Bottom 0.508: IC7.3 R80.1
N$132
  Bottom 0.508: R80.2 JP7.4
N$133
  Bottom 0.508: JP7.5 R81.2
N$134
  Bottom 0.508: R81.1 IC7.4
N$135
  Bottom 0.508: IC7.5 R82.1
N$136
  Bottom 0.508: R82.2 JP7.6
N$137
  Bottom 0.508: JP7.7 R83.2
N$138
  Bottom 0.508: R83.1 IC7.6
N$139
  Bottom 0.508: IC7.7 R84.1
N$140
  Bottom 0.508: R84.2 JP7.8
N$141
  Bottom 0.508: IC8.14 R85.2
N$142
  Bottom 0.508: R86.2 IC8.11
N$143
  Bottom 0.508: R120.2 51.04,86.36 49.97,87.43 46.55,87.43 45.92,86.8 45.92,85.92 46.99,84.85 IC6.12
N$144
  Bottom 0.508: R88.2 IC8.13
N$145
  Bottom 0.508: R89.2 92.71,92.71 87.63,87.63 JP8.1
N$146
  Bottom 0.508: R89.1 IC8.15
N$147
  Bottom 0.508: IC8.1 R90.1
N$148
  Bottom 0.508: R90.2 JP8.2
N$149
  Bottom 0.508: JP8.3 R91.2
N$150
  Bottom 0.508: R91.1 IC8.2
N$151
  Bottom 0.508: IC8.3 R92.1
N$152
  Bottom 0.508: R92.2 JP8.4
N$153
  Bottom 0.508: JP8.5 R93.2
N$154
  Bottom 0.508: R93.1 IC8.4
N$155
  Bottom 0.508: IC8.5 R94.1
N$156
  Bottom 0.508: R94.2 JP8.6
N$157
  Bottom 0.508: JP8.7 R95.2
N$158
  Bottom 0.508: IC8.6 R95.1
N$159
  Bottom 0.508: R96.1 IC8.7
N$160
  Bottom 0.508: R96.2 JP8.8
N$161
  Bottom 0.508: IC9.14 R97.2
N$162
  Bottom 0.508: R98.2 IC9.11
N$163
  Bottom 0.508: IC7.10 78.37,82.55 76.64,80.82 75.76,80.82 75.13,81.45 75.13,84.89 R123.2
N$164
  Bottom 0.508: R100.2 IC9.13
N$165
  Top 0.508: R101.2 113.03,55.88 113.03,29.21 Q1.G
  Bottom 0.508: R102.1 Q1.G
N$166
  Top 0.508: R103.2 114.3,54.61 114.3,43.18 Q2.G
  Bottom 0.508: Q2.G R104.1
N$167
  Top 0.508: R105.2 Q3.G
  Bottom 0.508: Q3.G R106.1
N$168
  Top 0.508: R107.2 128.27,58.42 137.16,58.42 143.51,52.07 Q4.G
  Bottom 0.508: R108.1 Q4.G
N$169  (via drill 0.35 pad 1)
  Top 0.508: v124.46,93.98 132.08,93.98 135.89,90.17 v135.89,71.12 | v125.73,58.42 134.62,49.53 134.62,45.72 135.89,45.72 135.89,27.94 132.08,24.13 Q5.G
  Bottom 0.508: R110.1 Q5.G | R109.2 120.65,93.98 v124.46,93.98 | v135.89,71.12 135.89,62.23 132.08,58.42 v125.73,58.42
N$170
  Top 0.508: R111.2 111.76,57.15 111.76,13.97 Q6.G
  Bottom 0.508: R112.1 Q6.G
N$171
  Top 0.508: R113.2 128.27,62.23 134.62,68.58 146.05,68.58 148.59,71.12 Q7.G
  Bottom 0.508: Q7.G R114.1
N$172
  Top 0.508: R115.2 133.35,63.5 148.59,63.5 Q8.G
  Bottom 0.508: Q8.G R116.1
N$173
  Bottom 0.508: R109.1 IC9.15
N$174
  Bottom 0.508: IC9.1 R111.1
N$175
  Bottom 0.508: R101.1 IC9.2
N$176
  Bottom 0.508: IC9.3 R103.1
N$177
  Bottom 0.508: R105.1 IC9.4
N$178
  Bottom 0.508: IC9.5 R107.1
N$179
  Bottom 0.508: IC9.6 R113.1
N$180
  Bottom 0.508: R115.1 IC9.7
N$181
  Bottom 0.508: IC8.9 107.95,88.9 118.11,99.06 R97.1
N$182
  Bottom 0.508: R13.1 39.37,46.99 27.94,35.56 IC1.9
N$183
  Bottom 0.508: R49.1 13.03,98.73 12.7,98.73 5.08,91.11 5.08,54.61 8.89,50.8 102.87,50.8 107.95,45.72 IC4.9
N$184
  Bottom 0.508: R61.1 39.7,98.73 39.37,98.73 27.94,87.3 IC5.9
N$185
  Bottom 0.508: IC1.10 25.03,30.48 23.3,28.75 22.42,28.75 21.79,29.38 21.79,32.82 R117.2
N$186
  Bottom 0.508: R118.2 51.04,34.29 49.97,35.36 46.55,35.36 45.92,34.73 45.92,33.85 46.99,32.78 IC2.12
N$187
  Bottom 0.508: R122.2 77.71,86.36 76.64,87.43 73.22,87.43 72.59,86.8 72.59,85.92 73.66,84.85 IC7.12
N$188
  Bottom 0.508: IC8.10 105.04,82.55 103.31,80.82 102.43,80.82 101.8,81.45 101.8,84.89 R125.2
N$189
  Bottom 0.508: R124.2 104.38,86.36 103.31,87.43 99.89,87.43 99.26,86.8 99.26,85.92 100.33,84.85 IC8.12
N$190
  Bottom 0.508: R99.2 21.59,85.09 21.59,81.65 22.42,80.82 23.3,80.82 25.03,82.55 IC5.10
N$191
  Bottom 0.508: IC5.12 20.32,84.85 19.25,85.92 19.25,86.8 19.88,87.43 23.3,87.43 24.37,86.36 R87.2
N$192
  Bottom 0.508: IC9.10 130.44,82.55 128.71,80.82 127.83,80.82 127.2,81.45 127.2,84.89 R27.2
N$193
  Bottom 0.508: R15.2 129.78,86.36 128.71,87.43 125.29,87.43 124.66,86.8 124.66,85.92 125.73,84.85 IC9.12
RCK  (via drill 0.35 pad 1)
  Top 0.508: v105.41,38.1 v78.74,38.1 v52.07,38.1 v25.4,38.1 10.16,38.1 v6.35,34.29 | v25.4,90.17 v52.07,90.17 v78.74,90.17 v105.41,90.17 107.95,90.17 v110.49,87.63 110.49,81.28 107.95,78.74 88.9,78.74 83.82,73.66 83.82,54.61 86.36,52.07 104.14,52.07 105.41,50.8 R63.1 | v113.03,87.63 115.57,90.17 v130.81,90.17
  Bottom 0.508: R63.1 v105.41,38.1 | v6.35,34.29 6.35,39.37 JP10.4 | R15.1 v130.81,90.17 | v110.49,87.63 v113.03,87.63 | R39.1 v78.74,38.1 | v52.07,38.1 R118.1 | R3.1 v25.4,38.1 | R87.1 v25.4,90.17 | R120.1 v52.07,90.17 | R122.1 v78.74,90.17 | R124.1 v105.41,90.17
SCK
  Top 0.508: R86.1 102.87,99.06 | 102.87,99.06 125.73,99.06 R98.1 | 102.87,99.06 76.2,99.06 | 76.2,99.06 R74.1 | 22.86,99.06 R50.1 | 76.2,99.06 49.53,99.06 | 49.53,99.06 22.86,99.06 | R62.1 49.53,99.06 | R2.1 22.86,46.99 | 22.86,46.99 49.53,46.99 | 49.53,46.99 R14.1 | 49.53,46.99 76.2,46.99 | 76.2,46.99 R26.1 | 76.2,46.99 102.87,46.99 R38.1 | JP10.3 8.89,41.91 10.16,43.18 10.16,46.99 | 10.16,46.99 22.86,46.99 | 10.16,46.99 10.16,48.26 3.81,54.61 3.81,93.98 8.89,99.06 22.86,99.06
SER
  Bottom 0.508: R1.1 12.7,46.99 10.16,44.45 JP10.2
SER1
  Bottom 0.508: R25.1 66.04,46.99 54.61,35.56 IC2.9
SER2
  Bottom 0.508: R37.1 92.71,46.99 81.28,35.56 IC3.9
SER3
  Bottom 0.508: R73.1 66.37,98.73 66.04,98.73 54.61,87.3 IC6.9
SER4
  Bottom 0.508: R85.1 93.04,98.73 92.71,98.73 81.28,87.3 IC7.9
VCC
  Top 0.508: C5.1 7.62,82.55 IC5.16 | C6.1 33.02,82.55 IC6.16 | C7.1 59.69,82.55 IC7.16 | C8.1 87.63,85.09 IC8.16 | C1.1 6.35,30.48 IC1.16 | C2.1 33.02,30.48 IC2.16 | C3.1 59.69,30.48 IC3.16 | C4.1 86.36,30.48 IC4.16
  Bottom 0.508: IC1.16 10.16,35.56 12.7,38.1 17.78,38.1 20.32,40.64 R117.1 20.32,46.99 19.05,48.26 | IC3.16 63.5,35.56 66.04,38.1 71.12,38.1 73.66,40.64 R51.1 73.66,46.99 72.39,48.26 | IC4.16 90.17,35.56 92.71,38.1 97.79,38.1 100.33,40.64 R75.1 100.33,46.99 99.06,48.26 72.39,48.26 | IC6.16 36.83,87.63 39.37,90.17 44.45,90.17 46.99,92.71 R121.1 46.99,99.06 45.72,100.33 | IC7.16 63.5,87.63 66.04,90.17 71.12,90.17 73.66,92.71 R123.1 73.66,99.06 72.39,100.33 | IC8.16 90.17,87.63 92.71,90.17 97.79,90.17 100.33,92.71 R125.1 100.33,99.06 99.06,100.33 | IC9.16 115.57,87.63 118.11,90.17 123.19,90.17 125.73,92.71 R27.1 125.73,99.06 125.09,99.69 | 19.05,48.26 45.72,48.26 | 45.72,48.26 72.39,48.26 | 2.54,53.34 7.62,48.26 19.05,48.26 | 2.54,53.34 2.54,91.44 11.43,100.33 19.05,100.33 | 125.09,99.69 124.46,100.33 99.06,100.33 | 19.05,100.33 45.72,100.33 | 45.72,100.33 72.39,100.33 | 72.39,100.33 99.06,100.33 | 19.05,100.33 20.32,99.06 R99.1 20.32,92.71 17.78,90.17 12.7,90.17 10.16,87.63 IC5.16 | JP10.1 2.54,53.34 | IC2.16 36.83,34.29 40.64,38.1 44.45,38.1 46.99,40.64 R119.1 46.99,46.99 45.72,48.26 | 125.09,99.69 131.44,99.69 138.43,92.71 C9.1

### Text on the board
Top: LED-Cube Controler